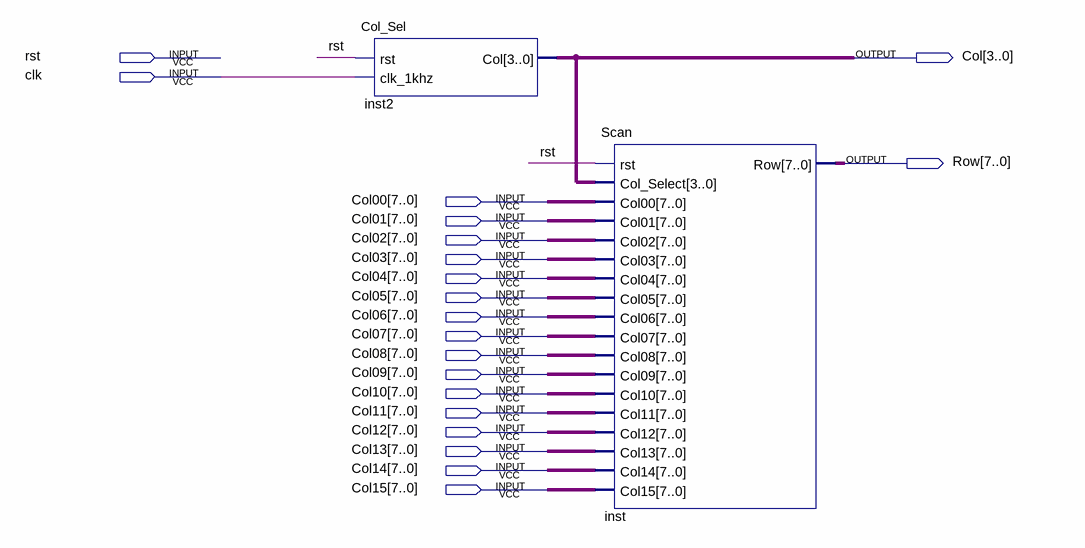
[diagram p0: schematic sheet]
// Quartus schematic LEDScanner.bdf as structural Verilog: 2 symbols, 20 pins
module LEDScanner (
  input  rst,
  input  clk,
  input  [7:0] Col00,
  input  [7:0] Col01,
  input  [7:0] Col02,
  input  [7:0] Col03,
  input  [7:0] Col04,
  input  [7:0] Col05,
  input  [7:0] Col06,
  input  [7:0] Col07,
  input  [7:0] Col08,
  input  [7:0] Col09,
  input  [7:0] Col10,
  input  [7:0] Col11,
  input  [7:0] Col12,
  input  [7:0] Col13,
  input  [7:0] Col14,
  input  [7:0] Col15,
  output [3:0] Col,
  output [7:0] Row
);

  Col_Sel inst2 (.rst(rst), .clk_1khz(clk), .Col(Col));
  Scan inst (
    .rst(rst), .Col_Select(Col), .Col00(Col00), .Col01(Col01), .Col02(Col02), .Col03(Col03), .Col04(Col04),
    .Col05(Col05), .Col06(Col06), .Col07(Col07), .Col08(Col08), .Col09(Col09), .Col10(Col10), .Col11(Col11),
    .Col12(Col12), .Col13(Col13), .Col14(Col14), .Col15(Col15), .Row(Row));
endmodule
